# EAGLE board CFT-PB2-smd-revD (EAGLE 5.11), part 1 of 2
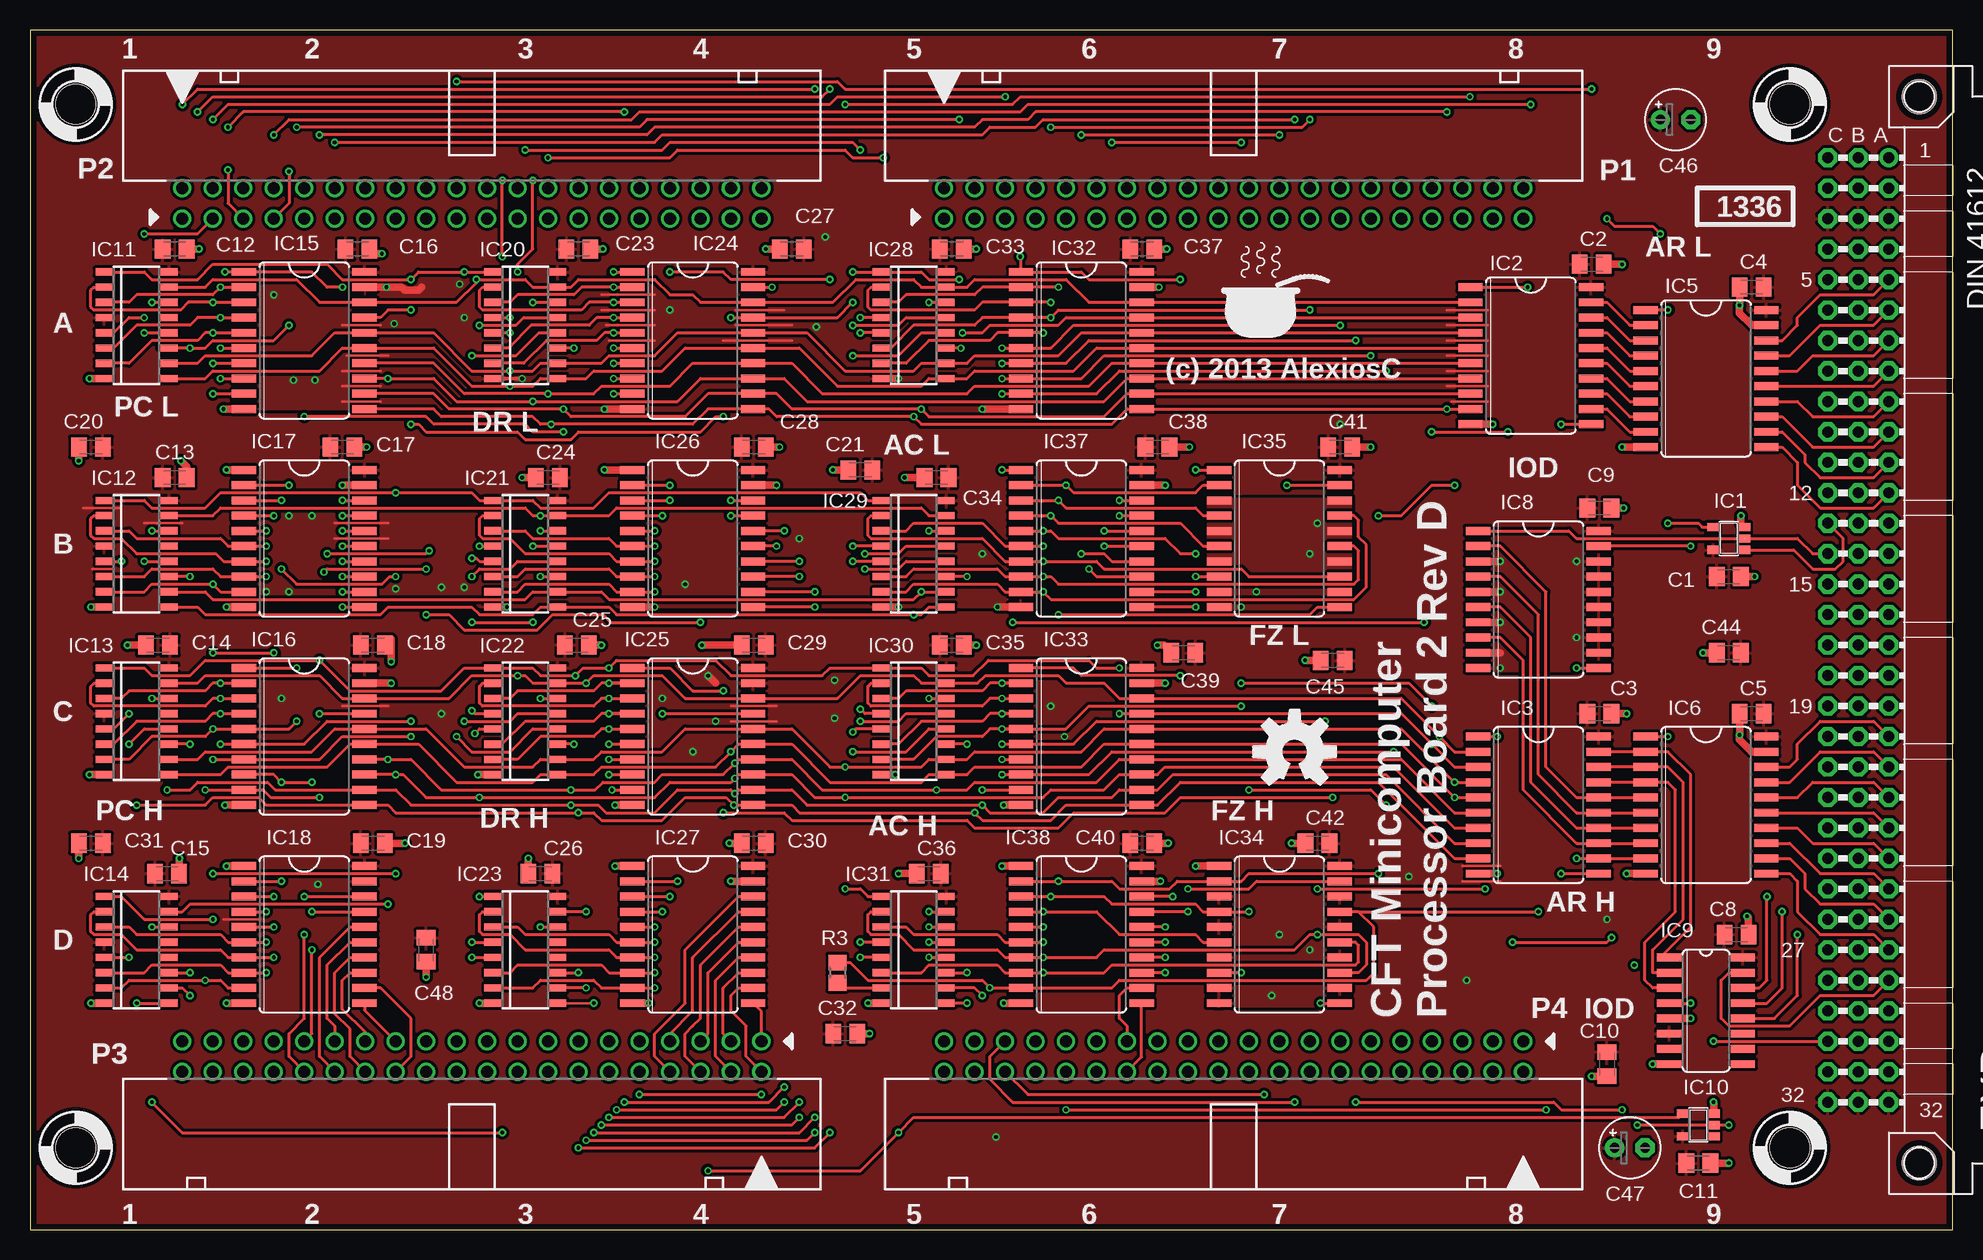
[diagram p6: board, top side]
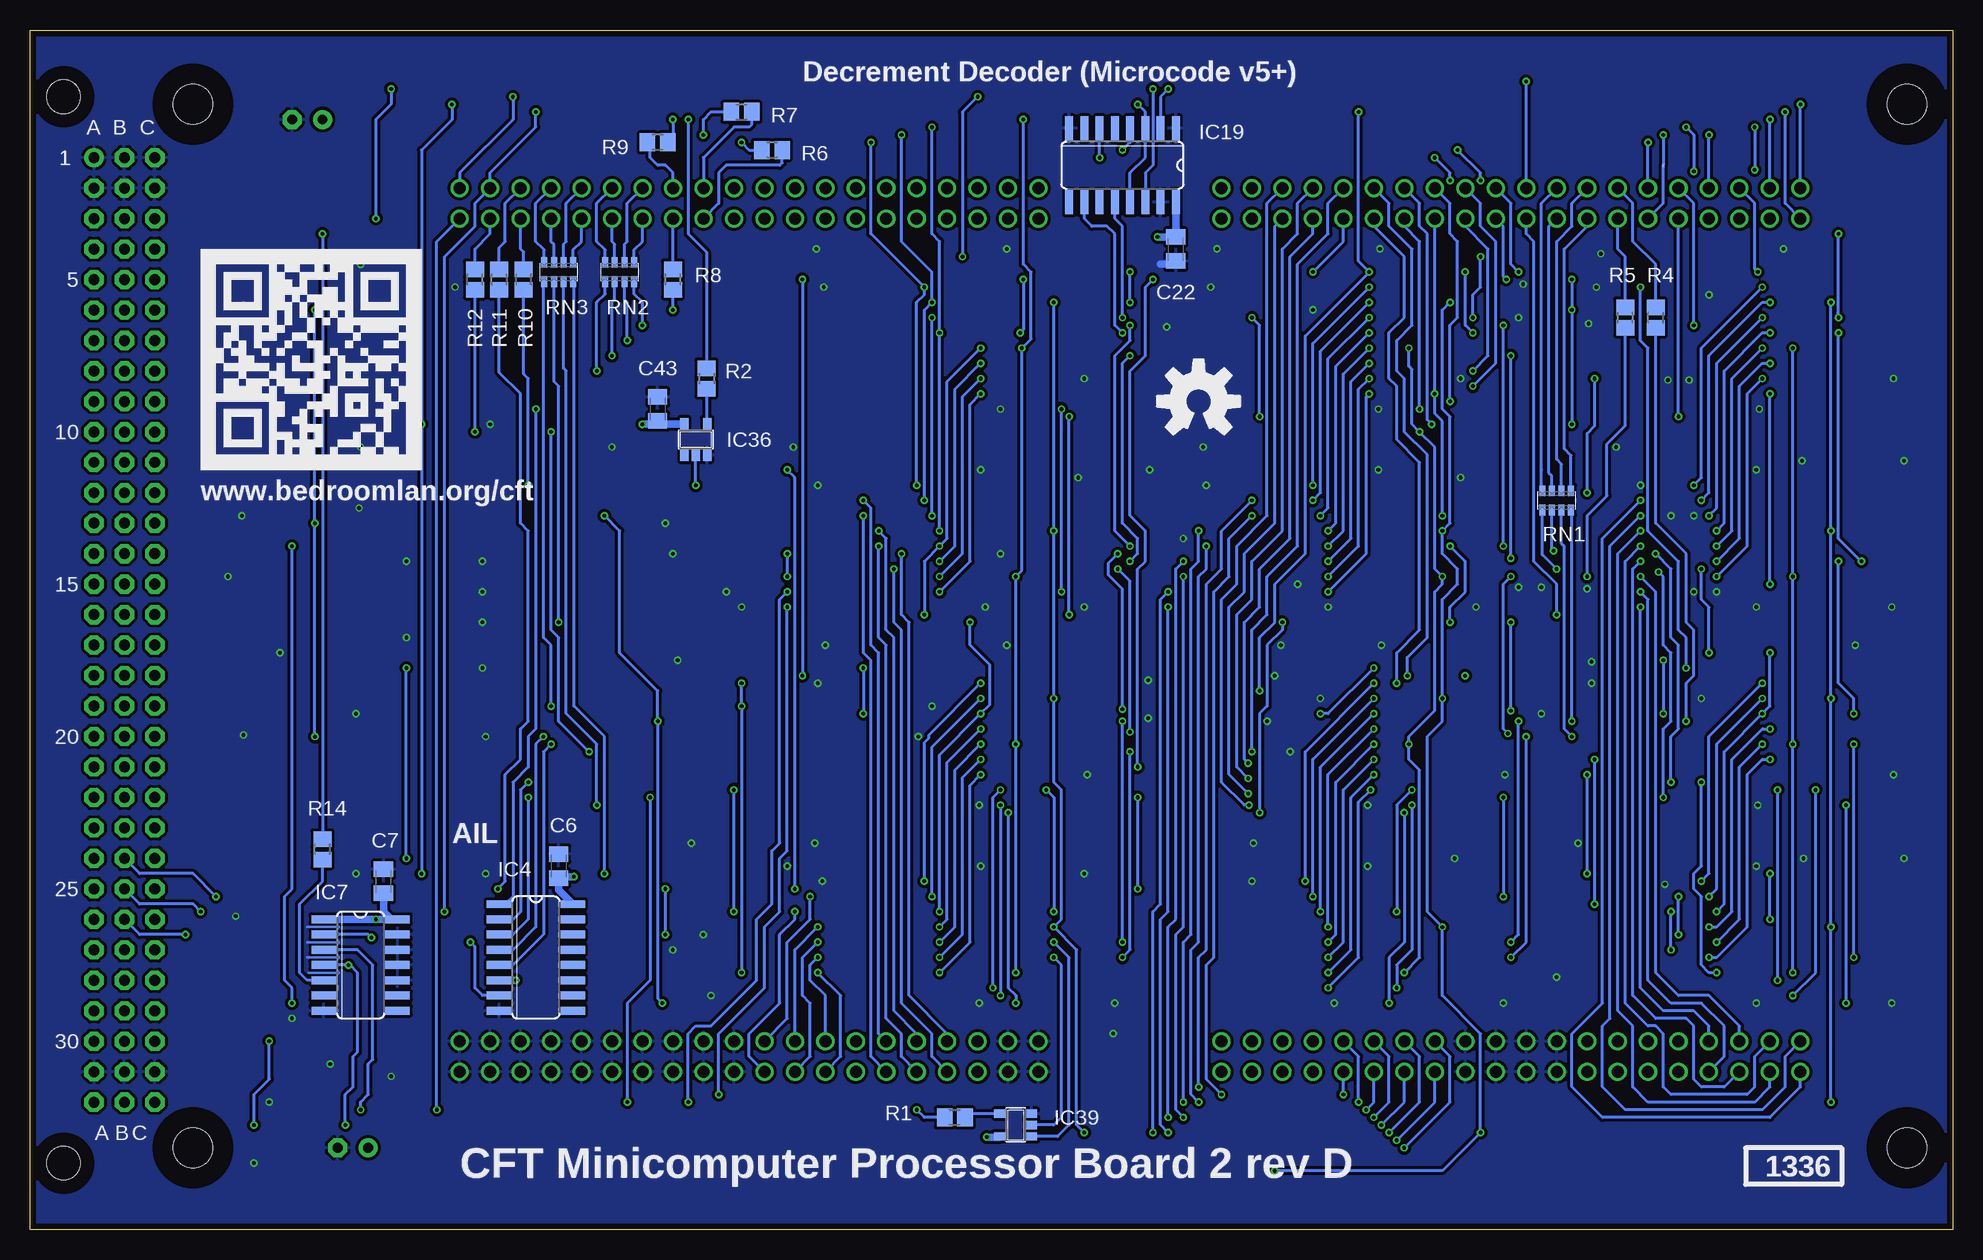
[diagram p7: board, bottom side, seen from below]

Size 160.27 x 100.03 mm. Coordinates in mm from the lower left corner, seen from the top.
Copper layers (1*16): Top 0.035mm / dielectric 1.5mm / Bottom 0.035mm
Design rules "smart-prototyping *": minimum track width 7mil, minimum drill 12mil, track to track 7mil, track to pad 7mil, pad to pad 7mil, via to via 7mil, smd to smd 0mil, copper to edge 20mil, drill to drill 10mil, minimum pad ring 10mil, minimum via ring 6mil, stop-mask expansion 2mil, vias tented up to drill 25mil, thermal gap 10mil
Net classes: 0 default: width 0.254 mm, clearance 0.152 mm; 1 low power: width 0.305 mm, clearance 0.152 mm; 2 LED power: width 0.406 mm, clearance 0.254 mm

## Footprints (pad centres in the part's own frame; a part is rotated, then mirrored left to right if it is on the bottom)
C0805K = smd 1.3 x 1.6: 1 -1,0; 2 1,0
E2,5-5 = drill 0.813 pad 1.6 round: + -1.27,0 | drill 0.813 pad 1.6 octagon: - 1.27,0
VG96K = drill 0.914 pad 1.6 round: A1 154.94,39.37 | drill 0.914 pad 1.6 octagon: A2 154.94,36.83; A3 154.94,34.29; A4 154.94,31.75; A5 154.94,29.21; A6 154.94,26.67; A7 154.94,24.13; A8 154.94,21.59; A9 154.94,19.05; A10 154.94,16.51; A11 154.94,13.97; A12 154.94,11.43; A13 154.94,8.89; A14 154.94,6.35; A15 154.94,3.81; A16 154.94,1.27; A17 154.94,-1.27; A18 154.94,-3.81; A19 154.94,-6.35; A20 154.94,-8.89; A21 154.94,-11.43; A22 154.94,-13.97; A23 154.94,-16.51; A24 154.94,-19.05; A25 154.94,-21.59; A26 154.94,-24.13; A27 154.94,-26.67; A28 154.94,-29.21; A29 154.94,-31.75; A30 154.94,-34.29; A31 154.94,-36.83; A32 154.94,-39.37; B1 152.4,39.37; B2 152.4,36.83; B3 152.4,34.29; B4 152.4,31.75; B5 152.4,29.21; B6 152.4,26.67; B7 152.4,24.13; B8 152.4,21.59; B9 152.4,19.05; B10 152.4,16.51; B11 152.4,13.97; B12 152.4,11.43; B13 152.4,8.89; B14 152.4,6.35; B15 152.4,3.81; B16 152.4,1.27; B17 152.4,-1.27; B18 152.4,-3.81; B19 152.4,-6.35; B20 152.4,-8.89; B21 152.4,-11.43; B22 152.4,-13.97; B23 152.4,-16.51; B24 152.4,-19.05; B25 152.4,-21.59; B26 152.4,-24.13; B27 152.4,-26.67; B28 152.4,-29.21; B29 152.4,-31.75; B30 152.4,-34.29; B31 152.4,-36.83; B32 152.4,-39.37; C1 149.86,39.37; C2 149.86,36.83; C3 149.86,34.29; C4 149.86,31.75; C5 149.86,29.21; C6 149.86,26.67; C7 149.86,24.13; C8 149.86,21.59; C9 149.86,19.05; C10 149.86,16.51; C11 149.86,13.97; C12 149.86,11.43; C13 149.86,8.89; C14 149.86,6.35; C15 149.86,3.81; C16 149.86,1.27; C17 149.86,-1.27; C18 149.86,-3.81; C19 149.86,-6.35; C20 149.86,-8.89; C21 149.86,-11.43; C22 149.86,-13.97; C23 149.86,-16.51; C24 149.86,-19.05; C25 149.86,-21.59; C26 149.86,-24.13; C27 149.86,-26.67; C28 149.86,-29.21; C29 149.86,-31.75; C30 149.86,-34.29; C31 149.86,-36.83; C32 149.86,-39.37 | hole 2.794: 157.48,44.45; 157.48,-44.45
SOT23-5 = smd 0.69 x 0.99: 1 -0.95,-1.29; 2 0,-1.29; 3 0.95,-1.29; 4 0.95,1.3; 5 -0.95,1.3
SO20W = smd 0.66 x 2.032: 1 -5.715,-5.029; 2 -4.445,-5.029; 3 -3.175,-5.029; 4 -1.905,-5.029; 5 -0.635,-5.029; 6 0.635,-5.029; 7 1.905,-5.029; 8 3.175,-5.029; 9 4.445,-5.029; 10 5.715,-5.029; 11 5.715,5.029; 12 4.445,5.029; 13 3.175,5.029; 14 1.905,5.029; 15 0.635,5.029; 16 -0.635,5.029; 17 -1.905,5.029; 18 -3.175,5.029; 19 -4.445,5.029; 20 -5.715,5.029
SO16 = smd 0.66 x 2.032: 1 -4.445,-3.073; 2 -3.175,-3.073; 3 -1.905,-3.073; 4 -0.635,-3.073; 5 0.635,-3.073; 6 1.905,-3.073; 7 3.175,-3.073; 8 4.445,-3.073; 9 4.445,3.073; 10 3.175,3.073; 11 1.905,3.073; 12 0.635,3.073; 13 -0.635,3.073; 14 -1.905,3.073; 15 -3.175,3.073; 16 -4.445,3.073
SO14 = smd 0.66 x 2.032: 1 -3.81,-3.073; 2 -2.54,-3.073; 3 -1.27,-3.073; 4 0,-3.073; 5 1.27,-3.073; 6 2.54,-3.073; 7 3.81,-3.073; 8 3.81,3.073; 9 2.54,3.073; 10 1.27,3.073; 11 0,3.073; 12 -1.27,3.073; 13 -2.54,3.073; 14 -3.81,3.073
SO16D = smd 0.6 x 1.4: 1 -4.445,-2.715; 2 -3.175,-2.715; 3 -1.905,-2.715; 4 -0.635,-2.715; 5 0.635,-2.715; 6 1.905,-2.715; 7 3.175,-2.715; 8 4.445,-2.715; 9 4.445,2.715; 10 3.175,2.715; 11 1.905,2.715; 12 0.635,2.715; 13 -0.635,2.715; 14 -1.905,2.715; 15 -3.175,2.715; 16 -4.445,2.715
PAK100/2500-5-40 = drill 1 pad 1.422 round: 1 -24.13,-1.27; 2 -24.13,1.27; 3 -21.59,-1.27; 4 -21.59,1.27; 5 -19.05,-1.27; 6 -19.05,1.27; 7 -16.51,-1.27; 8 -16.51,1.27; 9 -13.97,-1.27; 10 -13.97,1.27; 11 -11.43,-1.27; 12 -11.43,1.27; 13 -8.89,-1.27; 14 -8.89,1.27; 15 -6.35,-1.27; 16 -6.35,1.27; 17 -3.81,-1.27; 18 -3.81,1.27; 19 -1.27,-1.27; 20 -1.27,1.27; 21 1.27,-1.27; 22 1.27,1.27; 23 3.81,-1.27; 24 3.81,1.27; 25 6.35,-1.27; 26 6.35,1.27; 27 8.89,-1.27; 28 8.89,1.27; 29 11.43,-1.27; 30 11.43,1.27; 31 13.97,-1.27; 32 13.97,1.27; 33 16.51,-1.27; 34 16.51,1.27; 35 19.05,-1.27; 36 19.05,1.27; 37 21.59,-1.27; 38 21.59,1.27; 39 24.13,-1.27; 40 24.13,1.27
R0805 = smd 1.3 x 1.5: 1 -0.85,0; 2 0.85,0
CTS742C083 = smd 0.5 x 0.9: 1 -1.2,-0.8; 2 -0.4,-0.8; 3 0.4,-0.8; 4 1.2,-0.8; 5 1.2,0.8; 6 0.4,0.8; 7 -0.4,0.8; 8 -1.2,0.8
STANDOFF_28_60 = hole 3.302: 0,0
SIGNAL-RENAME = smd 0.305 x 0.152: P$1 0,0; P$2 0,0

## Placement (x,y rotation side)
$4_37_$  SIGNATURESILK  [SIGNATURE]  99.69,74.14 0 top
$4_39_$  OSHW-LOGOL  [OSHW-LOGO-L]  105.41,39.85 0 top
$4_39_$1  OSHW-LOGOL  [OSHW-LOGO-L]  62.87,69.06 0 bottom
$4_40_$  QRCODE-CFT  [CFT-QRCODE]  146.05,63.35 0 bottom
C1  0.1uF  [C0805K]  141.6,54.46 180 top
C2  0.1uF  [C0805K]  130.18,80.49 180 top
C3  0.1uF  [C0805K]  130.81,43.03 180 top
C4  0.1uF  [C0805K]  143.51,78.59 0 top
C5  0.1uF  [C0805K]  143.51,43.03 0 top
C6  0.1uF  [C0805K]  116.2,30.33 270 bottom
C7  0.1uF  [C0805K]  130.81,29.06 270 bottom
C8  0.1uF  [C0805K]  142.24,24.61 180 top
C9  0.1uF  [C0805K]  130.81,60.17 180 top
C10  1uF  [C0805K]  131.44,13.82 90 top
C11  0.1uF  [C0805K]  139.06,5.56 180 top
C12  0.1uF  [C0805K]  12.06,81.76 180 top
C13  0.1uF  [C0805K]  12.06,62.71 180 top
C14  0.1uF  [C0805K]  10.67,48.74 0 top
C15  0.1uF  [C0805K]  11.43,29.69 180 top
C16  0.1uF  [C0805K]  27.3,81.76 180 top
C17  0.1uF  [C0805K]  26.04,65.25 180 top
C18  0.1uF  [C0805K]  28.57,48.74 180 top
C19  0.1uF  [C0805K]  28.57,32.23 0 top
C20  1uF  [C0805K]  5.08,65.25 0 top
C21  1uF  [C0805K]  69.22,63.35 0 top
C22  0.1uF  [C0805K]  64.77,81.76 90 bottom
C23  0.1uF  [C0805K]  45.72,81.76 180 top
C24  0.1uF  [C0805K]  43.18,62.71 0 top
C25  0.1uF  [C0805K]  45.59,48.74 180 top
C26  0.1uF  [C0805K]  42.55,29.69 0 top
C27  0.1uF  [C0805K]  63.5,81.76 0 top
C28  0.1uF  [C0805K]  60.33,65.25 180 top
C29  0.1uF  [C0805K]  60.33,48.74 0 top
C30  0.1uF  [C0805K]  60.33,32.23 180 top
C31  1uF  [C0805K]  5.08,32.23 0 top
C32  1uF  [C0805K]  67.94,16.36 180 top
C33  0.1uF  [C0805K]  76.83,81.76 180 top
C34  0.1uF  [C0805K]  75.56,62.71 0 top
C35  0.1uF  [C0805K]  76.83,48.74 180 top
C36  0.1uF  [C0805K]  74.93,29.69 0 top
C37  0.1uF  [C0805K]  92.71,81.76 180 top
C38  0.1uF  [C0805K]  93.98,65.25 180 top
C39  0.1uF  [C0805K]  96.14,48.11 0 top
C40  0.1uF  [C0805K]  92.71,32.23 180 top
C41  0.1uF  [C0805K]  109.22,65.25 180 top
C42  0.1uF  [C0805K]  107.31,32.23 0 top
C43  0.1uF  [C0805K]  107.95,68.43 90 bottom
C44  1uF  [C0805K]  141.6,48.11 0 top
C45  1uF  [C0805K]  108.58,47.47 0 top
C46  47uF  [E2,5-5]  137.16,92.56 0 top
C47  47uF  [E2,5-5]  133.35,6.83 0 top
C48  1uF  [C0805K]  33.02,23.34 90 top
EXP  [VG96K]  0,50.01 0 top
IC1  74AHC1G08DBV  [SOT23-5]  141.6,57.63 90 top
IC2  74HC574D  [SO20W]  125.09,72.87 270 top
IC3  74HC574D  [SO20W]  125.73,35.41 270 top
IC4  74HC138D  [SO16]  118.11,22.71 270 bottom
IC5  74HC541DW  [SO20W]  139.7,70.97 270 top
IC6  74HC541DW  [SO20W]  139.7,35.41 270 top
IC7  74HC74D  [SO14]  132.72,22.07 270 bottom
IC8  74HC688DW  [SO20W]  125.73,52.55 270 top
IC9  74HC138D  [SO16]  139.7,18.26 270 top
IC10  74AHC1G04DBV  [SOT23-5]  139.06,8.74 90 top
IC11  74HC193D  [SO16D]  8.89,75.41 270 top
IC12  74HC193D  [SO16D]  8.89,56.36 270 top
IC13  74HC193D  [SO16D]  8.89,42.39 270 top
IC14  74HC193D  [SO16D]  8.89,23.34 270 top
IC15  74HC541DW  [SO20W]  22.86,74.14 270 top
IC16  74HC541DW  [SO20W]  22.86,41.12 270 top
IC17  74HC541DW  [SO20W]  22.86,57.63 270 top
IC18  74HC541DW  [SO20W]  22.86,24.61 270 top
IC19  74HC139D  [SO16]  69.22,88.75 180 bottom
IC20  74HC193D  [SO16D]  41.27,75.41 270 top
IC21  74HC193D  [SO16D]  41.27,56.36 270 top
IC22  74HC193D  [SO16D]  41.27,42.39 270 top
IC23  74HC193D  [SO16D]  41.27,23.34 270 top
IC24  74HC541DW  [SO20W]  55.24,74.14 270 top
IC25  74HC541DW  [SO20W]  55.24,41.12 270 top
IC26  74HC541DW  [SO20W]  55.24,57.63 270 top
IC27  74HC541DW  [SO20W]  55.24,24.61 270 top
IC28  74HC193D  [SO16D]  73.66,75.41 270 top
IC29  74HC193D  [SO16D]  73.66,56.36 270 top
IC30  74HC193D  [SO16D]  73.66,42.39 270 top
IC31  74HC193D  [SO16D]  73.66,23.34 270 top
IC32  74HC541DW  [SO20W]  87.63,74.14 270 top
IC33  74HC541DW  [SO20W]  87.63,41.12 270 top
IC34  74HC688DW  [SO20W]  104.14,24.61 270 top
IC35  74HC688DW  [SO20W]  104.14,57.63 270 top
IC36  74AHC1G04DBV  [SOT23-5]  104.78,65.89 0 bottom
IC37  74HC541DW  [SO20W]  87.63,57.63 270 top
IC38  74HC541DW  [SO20W]  87.63,24.61 270 top
IC39  74AHC1G08DBV  [SOT23-5]  78.11,8.74 90 bottom
P1  2540-5  [PAK100/2500-5-40]  100.33,85.57 0 top
P2  2540-5  [PAK100/2500-5-40]  36.83,85.57 0 top
P3  2540-5  [PAK100/2500-5-40]  36.83,14.45 180 top
P4  2540-5  [PAK100/2500-5-40]  100.33,14.45 180 top
R1  30R  [R0805]  83.19,9.37 0 bottom
R2  30R  [R0805]  103.89,70.97 270 bottom
R3  30R  [R0805]  67.31,21.44 270 top
R4  30R  [R0805]  24.77,76.05 90 bottom
R5  30R  [R0805]  27.3,76.05 90 bottom
R6  30R  [R0805]  98.42,90.02 0 bottom
R7  30R  [R0805]  100.97,93.19 0 bottom
R8  30R  [R0805]  106.68,79.22 90 bottom
R9  30R  [R0805]  107.95,90.65 180 bottom
R10  30R  [R0805]  119.13,79.22 90 bottom
R11  30R  [R0805]  121.16,79.22 90 bottom
R12  30R  [R0805]  123.19,79.22 90 bottom
R14  30R  [R0805]  135.89,31.72 90 bottom
RN1  30R  [CTS742C083]  33.02,60.81 180 bottom
RN2  30R  [CTS742C083]  111.12,79.86 180 bottom
RN3  30R  [CTS742C083]  116.2,79.86 180 bottom
U1  HOLE  [STANDOFF_28_60]  3.81,93.83 0 top
U2  HOLE  [STANDOFF_28_60]  3.81,6.83 0 top
U3  HOLE  [STANDOFF_28_60]  146.69,6.83 0 top
U4  HOLE  [STANDOFF_28_60]  146.69,93.83 0 top
X1  SIGNAL-RENAME  [SIGNAL-RENAME]  24.13,88.75 270 bottom

## Tracks (layer width: path | path; a pad name or v marks a point on that pad's centre or on a via)
!ABEN  (via drill 0.3)
  Top 0.254: v136.53,76.68 IC5.1 | IC6.1 v136.53,41.12 | IC1.4 139.38,58.58 139.06,58.9 v136.53,58.9
  Bottom 0.254: v136.53,41.12 v136.53,58.9 v136.53,76.68
!ACB1  (via drill 0.3)
  Top 0.254: IC29.4 v68.58,57 | v68.58,75.41 72.39,75.41 73.03,76.05 IC28.13
  Bottom 0.254: v68.58,57 69.85,58.27 69.85,72.87 68.58,74.14 v68.58,75.41
!ACB2  (via drill 0.3)
  Top 0.254: IC30.4 69.6,43.03 v69.22,43.41 | v69.6,56.36 72.39,56.36 73.03,57 IC29.13
  Bottom 0.254: v69.6,56.36 70.36,55.6 70.36,54.58 69.22,53.44 v69.22,43.41
!ACB3  (via drill 0.3)
  Top 0.254: IC31.4 v69.22,23.98 | v69.22,42.39 72.39,42.39 73.03,43.03 IC30.13
  Bottom 0.254: v69.22,23.98 v69.22,42.39
!ACC1  (via drill 0.3)
  Top 0.254: v68.58,72.87 72.39,72.87 74.3,74.78 IC28.12 | IC29.5 v68.58,55.73
  Bottom 0.254: v68.58,72.87 69.22,72.24 69.22,58.9 67.94,57.63 67.94,56.36 v68.58,55.73
!ACC2  (via drill 0.3)
  Top 0.254: IC30.5 68.83,41.76 v68.58,41.5 | v69.6,55.09 72.39,55.09 73.03,55.73 IC29.12
  Bottom 0.254: v68.58,41.5 68.58,54.08 v69.6,55.09
!ACC3  (via drill 0.3)
  Top 0.254: IC31.5 v69.22,22.71 | v68.58,39.85 73.03,39.85 74.93,41.76 IC30.12
  Bottom 0.254: v69.22,22.71 68.58,23.34 v68.58,39.85
!ACCPL  (via drill 0.3)
  Top 0.254: v86.36,10.01 v126.36,10.01
  Bottom 0.254: v126.36,10.01 126.36,82.4 P1.39 | R1.1 85.72,9.37 v86.36,10.01
!ACDOWN  (via drill 0.3)
  Top 0.254: IC28.4 v69.22,76.05
  Bottom 0.254: v69.22,76.05 69.22,83.67 69.85,84.3 IC19.12
!ACUP  (via drill 0.3)
  Top 0.254: IC28.5 v69.22,74.78
  Bottom 0.254: v69.22,74.78 69.85,75.41 69.85,83.03 70.48,83.67 71.75,83.67 72.39,84.3 IC19.10
!AINDEX  (via drill 0.3)
  Top 0.254: v35.56,95.73 67.31,95.73 67.94,95.1 v130.18,95.1 | v135.89,83.03 135.25,83.67 132.08,83.67 v131.44,84.3
  Bottom 0.254: P2.20 v35.56,95.73 | v135.89,83.03 R14.2 | v130.18,95.1 130.18,93.83 131.44,92.56 v131.44,84.3
!DEC  (via drill 0.3)
  Top 0.254: v67.94,93.83 81.92,93.83 82.55,94.46 v120.02,94.46
  Bottom 0.254: IC19.13 68.58,88.11 67.31,89.38 IC19.3 67.31,93.19 v67.94,93.83 | v120.02,94.46 120.02,92.56 124.46,88.11 P1.40
!DECCPL  (via drill 0.3)
  Top 0.254: v74.93,23.98 IC31.13
  Bottom 0.254: v74.93,23.98 73.66,22.71 73.66,8.74 74.61,7.79 IC39.1
!DRB1  (via drill 0.3)
  Top 0.254: IC20.13 41.15,76.05 40.51,75.41 v37.47,75.41 | v37.47,57 IC21.4
  Bottom 0.254: v37.47,57 v37.47,75.41
!DRB2  (via drill 0.3)
  Top 0.254: v41.91,57 IC21.13 | v36.83,50.65 v41.91,50.65 | v36.83,43.28 37.08,43.03 IC22.4
  Bottom 0.254: v41.91,50.65 41.91,51.92 40.64,53.19 40.64,55.73 v41.91,57 | v36.83,43.28 v36.83,50.65
!DRB3  (via drill 0.3)
  Top 0.254: v36.83,23.98 IC23.4 | v36.2,42.39 40.01,42.39 40.64,43.03 IC22.13
  Bottom 0.254: v36.83,23.98 36.2,24.61 v36.2,42.39
!DRC1  (via drill 0.3)
  Top 0.254: IC20.12 42.42,74.78 40.51,72.87 v36.83,72.87 | v36.83,55.98 37.21,55.98 37.47,55.73 IC21.5
  Bottom 0.254: v36.83,55.98 v36.83,72.87
!DRC2  (via drill 0.3)
  Top 0.254: IC21.12 40.64,55.73 40.01,55.09 37.47,55.09 v36.83,54.46 | v37.08,41.38 37.47,41.76 IC22.5
  Bottom 0.254: v37.08,41.38 37.47,41.76 37.47,53.82 v36.83,54.46
!DRC3  (via drill 0.3)
  Top 0.254: v36.83,22.71 IC23.5 | v35.56,41.12 36.83,39.85 40.01,39.85 41.91,41.76 IC22.12
  Bottom 0.254: v36.83,22.71 35.56,23.98 v35.56,41.12
!DRDOWN  (via drill 0.3)
  Top 0.254: v39.37,81.13 v39.37,87.48 | IC20.4 v40.01,76.05 | v41.27,90.02 52.7,90.02 53.34,90.65 68.58,90.65 v69.22,90.02
  Bottom 0.254: v69.22,90.02 68.58,90.65 IC19.4 | v39.37,87.48 39.37,88.11 v41.27,90.02 | v39.37,81.13 39.37,78.59 40.01,77.95 v40.01,76.05
!DRUP  (via drill 0.3)
  Top 0.254: IC20.5 v40.01,74.78 | v41.91,87.48 41.91,81.76 40.64,80.49 v40.64,79.86 | v43.18,89.38 53.34,89.38 53.98,90.02 67.94,90.02 68.58,89.38 v71.12,89.38
  Bottom 0.254: v71.12,89.38 IC19.6 | v40.01,74.78 40.64,75.41 v40.64,79.86 | v41.91,87.48 41.91,88.11 v43.18,89.38
!FZERO  (via drill 0.3)
  Top 0.254: v104.78,62.08 IC35.19
  Bottom 0.254: v104.78,62.08 IC36.2
!INCCPL  (via drill 0.3)
  Top 0.254: v74.93,22.71 IC31.12
  Bottom 0.254: v74.93,22.71 74.3,22.07 74.3,9.37 74.93,8.74 IC39.2
!INCPC  (via drill 0.3)
  Top 0.254: v9.53,83.03 13.97,83.03 P2.3 | v9.53,76.05 8.26,76.05 6.99,74.78 IC11.5
  Bottom 0.254: v9.53,76.05 v9.53,83.03
!IO
  Top 0.254: IC8.1 128.27,58.27 128.91,57.63 IC1.2 147.32,57.63 148.59,56.36 EXP.C14
!IODEV1XX  (via drill 0.3)
  Top 0.254: IC9.14 144.15,20.17 144.78,20.8 v144.78,27.79
  Bottom 0.254: v144.78,27.79 146.69,29.69 151.13,29.69 EXP.B24
!IODEV2XX  (via drill 0.3)
  Top 0.254: v146.05,26.52 146.05,20.17 144.78,18.9 IC9.13
  Bottom 0.254: EXP.B25 151.13,27.15 146.69,27.15 v146.05,26.52
!IODEV3XX  (via drill 0.3)
  Top 0.254: IC9.12 145.41,17.63 147.32,19.53 v147.32,24.61
  Bottom 0.254: v147.32,24.61 151.13,24.61 EXP.B26
!IS_AUTOINDEX  (via drill 0.3)
  Top 0.254: v123.57,23.98 131.44,23.98 v131.83,24.36
  Bottom 0.254: IC4.7 122.56,19.53 123.19,20.17 123.19,23.6 v123.57,23.98 | v131.83,24.36 132.08,24.61 IC7.2
!MEM
  Top 0.254: EXP.C13 151.13,57.63 151.13,55.73 150.5,55.09 148.59,55.09 147,56.68 IC1.1
!RAC  (via drill 0.3)
  Top 0.254: v95.89,79.22 88.27,79.22 87.63,79.86 IC32.1 82.55,79.91 v82.55,81.13 | v95.89,46.2 87.63,46.2 87,46.84 IC33.1 | v15.24,92.56 16.51,93.83 66.67,93.83 67.31,94.46 v81.28,94.46
  Bottom 0.254: v95.89,79.22 v95.89,46.2 | P2.4 v15.24,92.56 | v81.28,94.46 82.55,93.19 v82.55,81.13
!RDR  (via drill 0.3)
  Top 0.254: v16.51,88.37 16.51,85.57 P2.5 | v48.64,79.86 IC24.1 | v49.53,93.19 17.78,93.19 v16.51,91.92 | IC25.1 53.34,46.84 55.24,44.93 v57.78,44.93
  Bottom 0.254: v57.78,44.93 57.78,49.38 56.52,50.65 56.52,53.82 53.98,56.36 53.98,74.52 v48.64,79.86 49.53,80.75 v49.53,93.19 | v16.51,91.92 v16.51,88.37
!RESET  (via drill 0.3)
  Top 0.254: v141.6,8.74 IC10.2 v133.99,8.74 | v140.34,15.72 EXP.C30
  Bottom 0.254: v133.99,8.74 133.99,11.28 133.35,11.91 133.35,14.45 132.97,14.83 132.97,21.44 133.6,22.07 v133.73,22.07 IC7.4 | v141.6,8.74 141.6,11.28 140.34,12.55 v140.34,15.72
!RPC  (via drill 0.3)
  Top 0.254: v16.26,79.86 IC15.1 23.5,79.86 24.77,78.59 v26.04,78.59 | IC16.1 v22.23,46.84
  Bottom 0.254: v16.26,79.86 16.51,80.11 16.51,85.57 P2.6 | v22.23,46.84 22.23,49.38 22.86,50.01 22.86,55.73 25.4,58.27 25.4,73.51 26.04,74.14 v26.04,78.59
!STPAC  (via drill 0.3)
  Top 0.254: v66.67,95.1 66.04,94.46 15.24,94.46 v13.97,93.19
  Bottom 0.254: IC19.14 67.31,88.11 66.67,88.75 v66.67,95.1 | v13.97,93.19 13.97,85.57 P2.1
!STPDR  (via drill 0.3)
  Top 0.254: v12.7,93.83 13.97,95.1 v65.41,95.1
  Bottom 0.254: v65.41,95.1 66.04,94.46 IC19.2 | P2.2 v12.7,93.83
!SYSDEV
  Top 0.254: IC9.15 141.6,21.44 140.97,20.8 140.97,17.63 141.6,16.99 146.69,16.99 149.22,19.53 153.67,19.53 EXP.A28
!WAC  (via drill 0.3)
  Top 0.254: IC31.11 v78.11,21.44 | v78.11,40.49 IC30.11 | v78.11,54.46 IC29.11 | v77.6,73.51 IC28.11 | v21.59,88.24 21.59,85.57 P2.7 | v22.23,91.92 50.8,91.92 51.44,92.56 v77.47,92.56
  Bottom 0.254: v78.11,21.44 v78.11,40.49 v78.11,54.46 77.6,54.97 v77.6,73.51 76.83,74.27 76.83,79.86 77.47,80.49 v77.47,92.56 | v21.59,88.24 21.59,91.29 v22.23,91.92
!WAR  (via drill 0.3)
  Top 0.254: v127.64,67.16 IC2.11 | v127.64,29.69 IC3.11 | v125.09,93.83 83.19,93.83 82.55,93.19 50.8,93.19 50.16,92.56 21.59,92.56 v20.32,91.29
  Bottom 0.254: v127.64,29.69 v127.64,67.16 127.64,90.02 125.09,92.56 v125.09,93.83 | P2.8 v20.32,91.29
!WDR  (via drill 0.3)
  Top 0.254: IC23.11 v45.72,21.44 | v45.34,40.49 IC22.11 | v42.55,54.46 IC21.11 | v45.34,73.51 IC20.11 | v22.86,67.79 33.02,67.79 33.66,67.16 41.27,67.16 41.91,66.52 v44.45,66.52
  Bottom 0.254: v45.72,21.44 44.45,22.71 44.45,38.33 45.34,39.22 v45.34,40.49 45.34,41.12 43.18,43.28 43.18,53.19 42.55,53.82 v42.55,54.46 43.18,55.09 43.18,65.25 v44.45,66.52 45.09,67.16 45.09,71.73 45.34,71.98 v45.34,73.51 | v22.86,67.79 P2.9
!WIR  (via drill 0.3)
  Top 0.254: v33.02,51.28 34.92,51.28 36.2,50.01 42.29,50.01 43.56,51.28 47.75,51.28 48.39,50.65 v55.88,50.65 | v57.78,34.77 62.87,34.77 63.5,34.14 78.11,34.14 78.74,33.5 85.72,33.5 87,34.77 94.61,34.77 95.89,36.04 v108.58,36.04 | v110.49,10.64 127,10.64 127.64,10.01 v132.72,10.01
  Bottom 0.254: v33.02,51.28 33.02,53.82 34.92,55.73 34.92,82.4 35.56,83.03 P2.19 | v55.88,50.65 55.88,50.01 57.15,48.74 57.15,43.66 57.78,43.03 v57.78,34.77 | v108.58,36.04 108.58,20.8 110.49,18.9 v110.49,10.64 | v132.72,10.01 132.72,10.64 132.08,11.28 132.08,13.82 131.7,14.2 131.7,22.07 132.97,23.34 IC7.3
!WPC  (via drill 0.3)
  Top 0.254: v21.59,75.41 20.32,74.14 15.24,74.14 14.61,73.51 v13.34,73.51 IC11.11 10.79,73.51 | v13.34,54.46 IC12.11 | v13.34,40.49 IC13.11 | IC14.11 v13.34,21.44
  Bottom 0.254: v21.59,75.41 21.59,85.57 P2.10 | v13.34,73.51 v13.34,54.46 v13.34,40.49 v13.34,21.44
+3.3V
  Top 0.254: EXP.C4 EXP.B4 EXP.A4
AB0
  Top 0.254: IC5.18 146.05,74.14 147.32,75.41 147.32,76.05 149.22,77.95 153.67,77.95 EXP.A5
AB1
  Top 0.254: IC5.17 146.69,72.87 149.22,75.41 153.67,75.41 EXP.A6
AB2
  Top 0.254: IC5.16 147.32,71.6 148.59,72.87 153.67,72.87 EXP.A7
AB3
  Top 0.254: IC5.15 153.67,70.33 EXP.A8
AB4
  Top 0.254: IC5.14 147.32,69.06 148.59,67.79 153.67,67.79 EXP.A9
AB5
  Top 0.254: IC5.13 146.05,67.79 148.59,65.25 153.67,65.25 EXP.A10
AB6
  Top 0.254: IC5.12 146.05,66.52 147.96,64.62 147.96,63.98 149.22,62.71 153.67,62.71 EXP.A11
AB7
  Top 0.254: IC5.11 146.05,65.25 147.32,63.98 147.32,62.08 149.22,60.17 153.67,60.17 EXP.A12
AB8
  Top 0.254: IC6.18 146.69,38.58 147.32,39.22 147.32,40.49 149.22,42.39 153.67,42.39 EXP.A20
AB9
  Top 0.254: IC6.17 146.69,37.31 149.22,39.85 153.67,39.85 EXP.A21
AB10
  Top 0.254: IC6.16 147.32,36.04 148.59,37.31 153.67,37.31 EXP.A22
AB11
  Top 0.254: IC6.15 153.67,34.77 EXP.A23
AB12
  Top 0.254: IC6.14 147.32,33.5 148.59,32.23 153.67,32.23 EXP.A24
AB13
  Top 0.254: IC6.13 146.69,32.23 149.22,29.69 153.67,29.69 EXP.A25
AB14
  Top 0.254: IC6.12 146.69,30.96 147.96,29.69 147.96,28.42 149.22,27.15 153.67,27.15 EXP.A26
AB15
  Top 0.254: IC6.11 146.69,29.69 147.32,29.06 147.32,26.52 149.22,24.61 153.67,24.61 EXP.A27
AC0  (via drill 0.3)
  Top 0.254: IC28.3 72.39,77.32 73.03,77.95 78.74,77.95 79.38,78.59 IC32.2 v85.72,78.59 | IC35.2 97.79,62.08 97.16,61.44 87,61.44 v86.36,62.08 IC37.2 | v90.17,90.65 v100.97,90.65
  Bottom 0.254: v86.36,62.08 86.36,77.32 85.72,77.95 v85.72,78.59 90.17,83.03 v90.17,90.65 | R6.1 100.33,90.02 v100.97,90.65
AC1  (via drill 0.3)
  Top 0.254: IC28.2 70.1,78.59 69.85,78.33 69.85,76.94 70.1,76.68 78.74,76.68 79.38,77.32 IC32.3 v85.09,77.32 | IC35.4 97.79,59.54 97.16,60.17 86.36,60.17 v85.72,60.81 IC37.3 | v87.63,91.29 v104.14,91.29
  Bottom 0.254: v85.72,60.81 85.72,76.68 v85.09,77.32 85.09,79.86 87.63,82.4 v87.63,91.29 | R7.1 103.5,93.19 104.14,92.56 v104.14,91.29
AC2  (via drill 0.3)
  Top 0.254: IC28.6 71.75,73.51 73.66,75.41 78.74,75.41 79.38,76.05 IC32.4 v85.09,76.05 85.72,76.68 v106.68,76.68 | IC35.6 97.79,57 95.89,58.9 85.72,58.9 v85.09,59.54 IC37.4
  Bottom 0.254: v85.09,59.54 v85.09,76.05 | v106.68,76.68 R8.1
AC3  (via drill 0.3)
  Top 0.254: IC28.7 73.03,72.24 74.93,74.14 80.01,74.14 80.64,74.78 IC32.5 v84.45,74.78 | IC37.5 v84.45,58.27 85.09,58.27 85.72,57.63 94.61,57.63 95.89,56.36 v97.16,56.36 | v97.16,54.46 IC35.8 | v85.09,91.92 106.05,91.92 v106.68,92.56
  Bottom 0.254: v97.16,56.36 v97.16,54.46 | v85.09,91.92 85.09,83.03 84.45,82.4 v84.45,74.78 v84.45,58.27 | R9.1 106.68,91.07 v106.68,92.56
AC4  (via drill 0.3)
  Top 0.254: IC29.3 73.03,58.27 73.66,58.9 79.38,58.9 81.28,57 IC37.6 v84.45,57 | v85.72,51.28 106.68,51.28 107.31,51.92 IC35.11 | v81.03,73.51 IC32.6 85.09,73.51 87,75.41 v109.22,75.41
  Bottom 0.254: v85.72,51.28 85.72,55.73 v84.45,57 83.82,57.63 83.82,70.71 v81.03,73.51 | RN2.8 109.92,78.02 109.22,77.32 v109.22,75.41
AC5  (via drill 0.3)
  Top 0.254: IC29.2 70.1,59.54 69.85,59.28 69.85,57.89 70.1,57.63 79.38,57.63 81.28,55.73 IC37.7 v84.45,55.73 88.9,55.73 89.53,55.09 100.97,55.09 101.6,54.46 IC35.13 | v110.49,74.14 88.27,74.14 86.36,72.24 IC32.7 v81.03,72.24
  Bottom 0.254: v84.45,55.73 83.19,57 83.19,70.08 v81.03,72.24 | RN2.7 110.72,77.55 110.49,77.32 v110.49,74.14
AC6  (via drill 0.3)
  Top 0.254: IC29.6 73.03,54.46 73.66,55.09 80.64,55.09 81.28,54.46 IC37.8 v84.45,54.46 85.09,54.46 85.72,53.82 110.36,53.82 110.74,54.2 110.74,56.62 110.36,57 IC35.15 | v111.76,72.87 89.53,72.87 87.63,70.97 IC32.8 v81.03,70.97
  Bottom 0.254: v84.45,54.46 82.55,56.36 82.55,69.44 v81.03,70.97 | RN2.6 111.53,77.55 111.76,77.32 v111.76,72.87
AC7  (via drill 0.3)
  Top 0.254: IC29.7 73.03,53.19 73.66,53.82 80.64,53.82 81.28,53.19 IC37.9 v84.45,53.19 85.09,52.55 110.36,52.55 111.38,53.57 111.38,57.12 110.74,57.76 110.74,59.16 110.36,59.54 IC35.17 | IC32.9 v81.03,69.7 88.9,69.7 90.81,71.6 v113.03,71.6
  Bottom 0.254: v84.45,53.19 81.92,55.73 81.92,68.81 v81.03,69.7 | RN2.5 112.33,78.02 113.03,77.32 v113.03,71.6
AC8  (via drill 0.3)
  Top 0.254: IC30.3 72.39,44.3 73.03,44.93 79.38,44.93 80.01,45.57 IC33.2 v81.03,45.57 | IC38.2 v85.72,29.06 90.17,29.06 90.81,28.42 95,28.42 95.63,29.06 IC34.2 100.97,29.06 101.6,29.69 v112.39,29.69
  Bottom 0.254: v112.39,29.69 112.39,41.12 114.94,43.66 114.94,78.99 RN3.8 | v85.72,29.06 85.72,40.61 85.34,41 85.34,41.25 v81.03,45.57
AC9  (via drill 0.3)
  Top 0.254: IC30.2 70.1,45.57 69.85,45.31 69.85,43.92 70.1,43.66 79.38,43.66 80.01,44.3 v81.03,44.3 IC33.3 | IC38.3 v85.09,27.79 89.53,27.79 90.17,27.15 97.16,27.15 97.79,26.52 IC34.4 v101.6,26.52 | v101.6,36.68 111.76,36.68 v113.03,35.41
  Bottom 0.254: v113.03,35.41 113.03,40.49 115.57,43.03 115.57,71.6 115.81,71.84 RN3.7 | v101.6,26.52 v101.6,36.68 | v85.09,27.79 85.09,40.23 v81.03,44.3
AC10  (via drill 0.3)
  Top 0.254: IC30.6 72.39,40.49 74.3,42.39 79.38,42.39 80.01,43.03 IC33.4 v81.03,43.03 | IC34.6 97.79,23.98 97.16,24.61 90.81,24.61 88.9,26.52 v84.45,26.52 IC38.4 | v81.92,50.65 v116.2,50.65
  Bottom 0.254: RN3.6 116.61,70.73 116.2,70.33 v116.2,50.65 | v81.92,50.65 81.92,48.74 80.26,47.09 80.26,43.79 v81.03,43.03 84.45,39.6 v84.45,26.52
AC11  (via drill 0.3)
  Top 0.254: IC30.7 73.66,39.22 75.56,41.12 79.38,41.12 80.01,41.76 IC33.5 v81.03,41.76 86.36,41.76 88.27,43.66 v100.97,43.66 | IC38.5 v84.45,25.25 | v100.97,21.44 IC34.8 | v100.97,45.57 114.94,45.57 v116.84,43.66
  Bottom 0.254: v84.45,25.25 83.82,25.88 83.82,38.96 v81.03,41.76 | v100.97,21.44 v100.97,43.66 v100.97,45.57 | v116.84,43.66 116.84,48.74 117.47,49.38 117.47,78.99 RN3.5
AC12  (via drill 0.3)
  Top 0.254: IC31.3 73.03,25.25 73.66,24.61 80.64,24.61 81.28,23.98 IC38.6 v84.45,23.98 | IC33.6 v81.03,40.49 87,40.49 88.9,42.39 v107.95,42.39 | v107.57,18.9 IC34.11 | v112.39,59.54 114.3,59.54 116.84,62.08 v118.75,62.08
  Bottom 0.254: v84.45,23.98 83.19,25.25 83.19,38.33 v81.03,40.49 | v107.57,18.9 107.95,19.28 v107.95,42.39 107.95,44.93 111.12,48.11 111.12,58.27 v112.39,59.54 | R10.1 119.13,71.35 118.75,70.97 v118.75,62.08
AC13  (via drill 0.3)
  Top 0.254: IC31.2 70.1,26.52 69.85,26.26 69.85,24.87 70.1,24.61 72.39,24.61 73.66,23.34 80.64,23.34 81.28,22.71 IC38.7 v84.45,22.71 88.9,22.71 89.53,23.34 105.41,23.34 106.68,24.61 v107.31,24.61 110.74,24.61 111.38,23.98 111.38,22.07 110.74,21.44 IC34.13 | v81.03,39.22 IC33.7 | v107.31,28.42 v121.28,28.42
  Bottom 0.254: v84.45,22.71 82.55,24.61 82.55,37.69 v81.03,39.22 | v121.28,28.42 120.65,29.06 120.65,37.95 119.38,39.22 119.38,41.76 118.75,42.39 118.75,58.27 119.38,58.9 119.38,69.7 121.16,71.48 R11.1 | v107.31,24.61 v107.31,28.42
AC14  (via drill 0.3)
  Top 0.254: IC31.6 74.3,21.44 74.93,22.07 80.64,22.07 81.28,21.44 IC38.8 v84.45,21.44 89.53,21.44 90.17,22.07 110.49,22.07 110.74,22.33 110.74,23.72 110.49,23.98 IC34.15 | v81.03,37.95 IC33.8 88.27,37.95 90.17,39.85 v113.67,39.85 | v116.84,66.52 v123.19,66.52
  Bottom 0.254: v84.45,21.44 81.92,23.98 81.92,37.06 v81.03,37.95 | v116.84,66.52 116.84,50.01 116.2,49.38 116.2,42.39 v113.67,39.85 | v123.19,66.52 R12.1
AC15  (via drill 0.3)
  Top 0.254: v80.01,20.17 90.17,20.17 90.81,20.8 111.38,20.8 112.01,21.44 112.01,25.25 110.74,26.52 | v80.01,20.17 79.38,20.8 69.85,20.8 68.36,22.29 R3.1 | v80.01,20.17 IC38.9 | v79.38,36.68 IC33.9 | 110.74,26.52 v125.73,26.52 | 110.74,26.52 IC34.17 | v118.11,93.19 83.82,93.19 83.19,92.56 79.38,92.56 78.74,91.92 52.07,91.92 51.44,91.29 v24.13,91.29
  Bottom 0.254: v80.01,20.17 80.01,36.04 v79.38,36.68 | v24.13,91.29 X1.P$1 | v125.73,26.52 125.73,81.13 123.19,83.67 123.19,85.57 P1.38 121.92,88.11 118.11,91.92 v118.11,93.19
AR0
  Top 0.254: IC2.19 131.44,77.32 133.35,75.41 IC5.2
AR1
  Top 0.254: IC2.18 131.44,76.05 133.35,74.14 IC5.3
AR2
  Top 0.254: IC2.17 131.44,74.78 133.35,72.87 IC5.4
AR3
  Top 0.254: IC2.16 131.44,73.51 133.35,71.6 IC5.5
AR4
  Top 0.254: IC2.15 131.44,72.24 133.35,70.33 IC5.6
AR5
  Top 0.254: IC2.14 131.44,70.97 133.35,69.06 IC5.7
AR6
  Top 0.254: IC2.13 131.44,69.7 133.35,67.79 IC5.8
AR7
  Top 0.254: IC2.12 131.44,68.43 133.35,66.52 IC5.9
AR8
  Top 0.254: IC3.19 IC6.2 136.53,39.85 138.43,37.95 138.43,25.25 135.89,22.71 IC9.1
AR9
  Top 0.254: IC3.18 IC6.3 136.53,38.58 137.79,37.31 137.79,25.88 135.25,23.34 135.25,21.44 IC9.2
AR10
  Top 0.254: IC3.17 IC6.4 136.53,37.31 137.16,36.68 137.16,26.52 134.62,23.98 134.62,20.8 135.25,20.17 IC9.3
AR11
  Top 0.254: IC6.5 IC3.16 128.91,36.04 126.36,38.58 126.36,53.19 122.56,57 IC8.2
AR12
  Top 0.254: IC6.6 IC3.15 128.91,34.77 125.73,37.95 125.73,51.28 122.56,54.46 IC8.4
AR13
  Top 0.254: IC6.7 IC3.14 128.91,33.5 125.09,37.31 125.09,49.38 122.56,51.92 IC8.6
AR14
  Top 0.254: IC6.8 IC3.13 128.91,32.23 124.46,36.68 124.46,47.47 122.56,49.38 IC8.8
AR15  (via drill 0.3)
  Top 0.254: IC3.12 v128.91,30.96 IC6.9 | v128.91,46.84 IC8.11
  Bottom 0.254: v128.91,30.96 v128.91,46.84
DR0  (via drill 0.3)
  Top 0.254: IC20.3 40.01,77.32 40.64,77.95 45.34,77.95 45.97,78.59 v48.64,78.59 IC24.2 | IC26.2 v53.34,62.08
  Bottom 0.254: v48.64,78.59 53.34,73.89 v53.34,62.08
DR1  (via drill 0.3)
  Top 0.254: IC20.2 37.72,78.59 37.47,78.33 37.47,76.94 37.72,76.68 45.97,76.68 46.61,77.32 v48.64,77.32 IC24.3 | IC26.3 v53.34,60.81
  Bottom 0.254: v53.34,60.81 52.7,61.44 52.7,73.25 v48.64,77.32
DR2  (via drill 0.3)
  Top 0.254: IC20.6 39.88,73.51 41.78,75.41 46.61,75.41 47.24,76.05 v48.64,76.05 IC24.4 | IC26.4 v52.7,59.54
  Bottom 0.254: v52.7,59.54 52.07,60.17 52.07,72.62 v48.64,76.05
DR3  (via drill 0.3)
  Top 0.254: IC20.7 41.15,72.24 43.05,74.14 47.24,74.14 47.88,74.78 v48.64,74.78 IC24.5 | IC26.5 v52.07,58.27
  Bottom 0.254: v52.07,58.27 51.44,58.9 51.44,71.98 v48.64,74.78
DR4  (via drill 0.3)
  Top 0.254: IC21.3 41.27,58.27 41.91,57.63 48.26,57.63 48.9,57 IC26.6 v52.07,57 | v48.64,73.51 IC24.6
  Bottom 0.254: v52.07,57 50.8,58.27 50.8,71.35 v48.64,73.51
DR5  (via drill 0.3)
  Top 0.254: IC21.2 37.72,59.54 37.47,59.28 37.47,57.89 37.72,57.63 40.01,57.63 41.27,56.36 48.26,56.36 48.9,55.73 IC26.7 v52.07,55.73 | v48.64,72.24 IC24.7
  Bottom 0.254: v52.07,55.73 50.16,57.63 50.16,70.71 v48.64,72.24
DR6  (via drill 0.3)
  Top 0.254: IC21.6 40.64,54.46 41.27,55.09 48.26,55.09 48.9,54.46 IC26.8 v52.07,54.46 | v48.64,70.97 IC24.8
  Bottom 0.254: v52.07,54.46 49.53,57 49.53,70.08 v48.64,70.97
DR7  (via drill 0.3)
  Top 0.254: IC21.7 40.64,53.19 41.27,53.82 48.26,53.82 48.9,53.19 IC26.9 v52.07,53.19 | v48.64,69.7 IC24.9
  Bottom 0.254: v52.07,53.19 48.9,56.36 48.9,69.44 v48.64,69.7
DR8  (via drill 0.3)
  Top 0.254: IC22.3 40.01,44.3 40.64,44.93 46.99,44.93 47.62,45.57 IC25.2 v48.26,45.57 | IC27.2 v53.98,29.06
  Bottom 0.254: v53.98,29.06 53.98,39.85 v48.26,45.57
DR9  (via drill 0.3)
  Top 0.254: IC22.2 37.72,45.57 37.47,45.31 37.47,43.92 37.72,43.66 46.99,43.66 47.62,44.3 v48.26,44.3 IC25.3 | IC27.3 v53.34,27.79
  Bottom 0.254: v53.34,27.79 53.34,39.22 v48.26,44.3
DR10  (via drill 0.3)
  Top 0.254: IC22.6 39.37,40.49 41.27,42.39 46.99,42.39 47.62,43.03 IC25.4 v48.26,43.03 | IC27.4 v52.7,26.52
  Bottom 0.254: v48.26,43.03 52.7,38.58 v52.7,26.52
DR11  (via drill 0.3)
  Top 0.254: IC22.7 40.64,39.22 42.55,41.12 46.99,41.12 47.62,41.76 v48.26,41.76 IC25.5 | IC27.5 v52.07,25.25
  Bottom 0.254: v48.26,41.76 52.07,37.95 v52.07,25.25
DR12  (via drill 0.3)
  Top 0.254: IC23.3 40.64,25.25 41.27,24.61 48.26,24.61 48.9,23.98 IC27.6 v52.07,23.98 | v48.26,40.49 IC25.6
  Bottom 0.254: v48.26,40.49 51.44,37.31 51.44,24.61 v52.07,23.98
DR13  (via drill 0.3)
  Top 0.254: IC23.2 37.72,26.52 37.47,26.26 37.47,24.87 37.72,24.61 40.01,24.61 41.27,23.34 48.26,23.34 48.9,22.71 IC27.7 v52.07,22.71 | v48.26,39.22 IC25.7
  Bottom 0.254: v52.07,22.71 50.8,23.98 50.8,36.68 v48.26,39.22
DR14  (via drill 0.3)
  Top 0.254: IC23.6 40.01,21.44 40.64,22.07 47.62,22.07 48.26,21.44 IC27.8 v52.07,21.44 | v48.26,37.95 IC25.8
  Bottom 0.254: v52.07,21.44 50.16,23.34 50.16,36.04 v48.26,37.95
DR15  (via drill 0.3)
  Top 0.254: IC23.7 41.91,20.17 42.55,20.8 46.99,20.8 47.62,20.17 IC27.9 v52.07,20.17 | v48.51,36.68 IC25.9
  Bottom 0.254: v52.07,20.17 49.53,22.71 49.53,35.66 v48.51,36.68
FNEG
  Bottom 0.254: X1.P$2 24.13,85.57 P2.11
FZERO  (via drill 0.3)
  Top 0.254: v25.4,90.65 52.07,90.65 52.7,91.29 79.38,91.29 80.01,91.92 83.82,91.92 84.45,92.56 v105.41,92.56
  Bottom 0.254: v105.41,92.56 105.41,83.03 103.89,81.51 R2.1 | P2.12 v25.4,90.65
GND  (via drill 0.3)
  Top 0.203: 58.8,75.41 63.5,75.41 | 26.04,75.41 29.21,75.41 | 26.04,71.6 29.21,71.6 | 26.04,70.33 29.21,70.33 | 26.04,69.06 29.21,69.06 | 26.42,72.87 29.84,72.87 | 25.4,58.9 29.84,58.9 | 25.4,57.63 29.84,57.63 | 57.78,74.14 63.5,74.14 | 47.62,77.95 52.07,77.95 | 47.62,76.68 52.07,76.68 | 48.01,75.41 52.07,75.41 | 48.26,74.14 52.07,74.14 | 58.8,76.68 62.87,76.68 | 26.04,43.66 29.84,43.66 | 58.42,43.66 62.23,43.66 | 58.42,42.39 62.23,42.39
  Top 0.254: v81.03,63.35 IC37.1 | v142.49,41.25 142.51,41.27 | IC2.1 v124.84,78.59 | IC3.1 v122.3,41.12 | IC24.19 v61.85,78.59
  Top 0.305: IC20.8 v41.02,70.97
  Top 0.61: v4.95,70.97 IC11.8 | IC12.8 v5.08,51.92 | v16.38,51.92 IC17.10 | v4.95,37.95 IC13.8 | v16.26,35.41 IC16.10 | IC14.8 v5.08,18.9 | v16.38,18.9 IC18.10 | v37.47,18.9 IC23.8 | IC27.10 v51.56,18.9 | IC31.8 v69.85,18.9 | v81.15,18.9 IC38.10 | v37.34,37.95 IC22.8 | IC25.10 v48.77,35.41 | IC21.8 v39.75,51.92 | IC26.10 v52.07,51.92 | v47.88,68.43 IC24.10 | v16.38,63.35 IC17.1 | IC17.19 v26.04,62.08 | IC29.8 v72.39,51.92 | v80.64,51.92 IC37.10 | IC28.8 v72.39,70.97 | v79.38,68.43 IC32.10 | v81.15,35.41 IC33.10 | IC30.8 v72.14,37.95 | IC38.19 v94.23,29.06 | IC27.19 v58.42,29.06 | IC27.1 v48.77,30.33 | v16.38,30.33 IC18.1 | IC15.19 v29.72,78.59 30.99,78.59 31.24,78.33 32.38,78.33 32.64,78.59 | v47.88,63.35 IC26.1 | IC26.19 v62.23,62.08 | IC37.19 v94.61,62.08 | IC32.19 v94.11,78.59 | v133.1,29.69 IC6.10 | IC3.10 v122.3,29.69 | IC6.19 143.51,39.85 142.49,40.87 v142.49,41.25 | v132.72,65.25 IC5.10 | IC2.10 v121.92,67.16 | IC9.8 v135.25,13.82 | v16.13,68.43 IC15.10 | v81.03,30.33 IC38.1 | IC33.19 v94.61,45.57 | v97.16,30.33 IC34.1 | C2.1 v132.72,80.49 | C3.1 v133.1,43.03 | C4.1 142.51,77.08 v142.49,77.06 142.49,76.43 143.51,75.41 IC5.19 | 142.51,41.27 C5.1 | C1.1 v143.76,54.46 | v142.62,59.54 142.62,58.86 IC1.3 | C9.1 v132.84,60.17 | C8.1 143.24,26.03 v143.13,26.14 | C11.1 v141.6,5.56 | C12.1 v14.1,81.76 | C15.1 12.45,29.69 v12.45,30.96 | C16.1 28.3,81.4 29.32,81.4 v29.34,81.38 | C18.1 30.1,49.27 v30.1,47.35 | 29.57,31.87 C19.2 v31.24,32.23 | IC16.19 v30.1,45.57 | C33.1 v78.87,81.76 | C23.1 v47.75,81.76 | C25.1 v47.62,48.74 | v58.29,32.23 C30.2 | v72.39,29.69 C36.1 | C40.1 v94.87,32.23 | C35.1 v78.87,48.74 | v56.01,48.74 C29.1 | C42.1 v105.16,32.23 | v72.9,62.71 C34.1 | C28.1 v62.48,65.25 | C24.1 v41.02,62.71
  Top 0.61: C17.1 v28.07,65.25 | C41.1 v111.76,65.25 | C37.1 v94.74,81.76 | C14.1 v8.13,48.74 | 57.15,45.57 v56.52,46.2 | v106.3,47.47 C45.1 | C21.1 v66.93,63.35 | C26.1 41.53,29.71 v41.53,30.96 | IC9.5 v138.43,17.63 | v140.34,10.64 140.34,9.71 IC10.3 | v130.18,12.8 131.43,12.8 C10.1 | C31.1 4.06,32.22 v4.06,30.96 | IC8.7 v122.56,50.65 | IC8.5 v122.56,53.19 | IC8.3 v122.56,55.73 | IC8.9 122.56,48.11 | C20.1 4.06,65.24 v4.06,64.11 | C32.1 v69.98,16.36 | v139.45,48.11 C44.1 | C13.1 13.06,63.62 v12.57,64.11 | C27.1 v61.34,81.76 | C48.1 v33.02,21.06 | C39.1 94.5,48.74 v93.98,48.74 | C38.1 v96.65,65.25
  Bottom 0.203: 134.49,25.25 137.16,25.25 | 134.49,23.98 137.16,23.98 | 134.49,22.71 137.16,22.71 | 134.49,21.44 137.03,21.44
  Bottom 0.61: C22.1 64.77,80.49 66.04,80.49
  other vias: 103.5,19.53 107.31,58.9 106.68,56.36 104.14,24.61 128.91,49.38 106.68,23.34 100.97,51.92 102.23,53.19 24,28.8 21.59,59.54 19.68,53.19 23.5,59.54 21.59,53.19 36.2,53.57 34.29,53.57 30.48,53.44 54.61,53.82 64.14,57.63 79.38,56.36 20.32,77.95 21.97,70.84 23.75,70.84 36.2,76.05 65.53,75.29 53.34,76.68 20.95,44.3 34.29,43.03 52.7,44.3 55.24,39.85 57.15,42.39 67.06,42.65 85.09,43.66 67.06,45.82 86.23,41.12 122.56,46.84 35.81,78.84 30.35,75.54 128.91,55.73
  pour Bottom (isolate 0.254, rank 6): 0,100.18 0,0.48 160.02,0.48 160.02,100.18
  pour Top (isolate 0.254, rank 4): 98.17,18.64 110.11,18.64 110.11,29.31 98.17,29.31
  pour Top (isolate 0.254, rank 4, no thermals): 98.17,51.66 110.11,51.66 110.11,60.93 98.17,60.93
  pour Top (isolate 0.254, rank 4): 121.67,46.58 131.7,46.58 131.7,57.63 128.91,57.63 128.27,58.27 121.67,58.27
  pour Top (isolate 0.254): 19.05,60.81 41.91,60.81 42.55,60.17 47.62,60.17 48.9,61.44 69.22,61.44 69.85,60.81 71.75,60.81 71.75,60.17 74.3,60.17 74.93,59.54 75.56,59.54 75.56,58.9 79.38,58.9 81.28,57 82.55,57 82.55,51.92 19.05,51.92
  pour Top (isolate 0.254): 19.05,79.22 24.13,79.22 26.04,77.32 34.92,77.32 36.83,79.22 41.27,79.22 41.91,78.59 46.99,78.59 47.62,79.22 52.07,79.22 53.34,77.95 55.24,77.95 55.88,77.32 67.31,77.32 69.22,79.22 73.66,79.22 74.3,78.59 74.93,78.59 74.93,76.68 75.56,76.05 76.2,76.05 76.2,75.41 80.01,75.41 81.92,73.51 83.19,73.51 83.19,67.79 74.93,67.79 74.3,68.43 55.24,68.43 54.61,67.79 45.09,67.79 44.45,68.43 19.05,68.43
  pour Top (isolate 0.254): 19.05,46.2 19.05,38.58 91.44,38.58 91.44,46.2 78.74,46.2 78.11,45.57 75.56,45.57 74.3,46.84 66.67,46.84 66.04,46.2 58.42,46.2 57.15,47.47 53.98,47.47 52.7,46.2 51.44,46.2 51.44,45.57 41.91,45.57 41.27,46.2 36.83,46.2 34.92,44.3 26.04,44.3 24.13,46.2
  pour Top (isolate 0.254): 27.94,79.22 27.94,77.32 35.56,77.32 37.47,79.22 37.47,79.86 32.38,79.86 31.75,79.22
  pour Top (isolate 0.254): 17.78,29.69 17.78,27.15 27.3,27.15 27.3,29.69
IBUS0  (via drill 0.3)
  Top 0.254: IC11.15 14.61,78.59 15.24,79.22 22.23,79.22 24.13,77.32 IC15.18 35.56,77.32 37.21,78.97 v37.21,79.22 41.27,79.22 41.91,78.59 IC20.15 45.09,78.59 45.72,79.22 52.07,79.22 53.34,77.95 55.24,77.95 55.88,77.32 IC24.18 66.93,77.32 68.83,79.22 73.66,79.22 74.3,78.59 IC28.15 78.11,78.59 78.74,79.22 86.36,79.22 88.27,77.32 IC32.18 IC2.2
  Bottom 0.254: P2.21 37.47,83.67 37.47,79.48 v37.21,79.22
IBUS1  (via drill 0.3)
  Top 0.254: IC2.3 IC32.17 86.36,76.05 85.72,75.41 80.01,75.41 79.38,74.78 v77.72,74.78 | IC11.1 9.53,79.86 10.16,79.22 13.97,79.22 15.24,80.49 24.77,80.49 26.04,79.22 v31.75,79.22 32.38,79.86 v36.2,79.86 IC20.1 38.73,80.03 | v31.75,76.68 29.84,76.68 29.21,76.05 IC15.17 | v77.47,79.22 74.93,79.22 74.3,79.86 IC28.1 v68.58,79.86 | v68.58,77.32 67.31,76.05 IC24.17 v58.42,76.05 | v31.75,67.16 32.38,67.16 33.02,66.52 40.64,66.52 41.27,65.89 45.09,65.89 45.72,66.52 55.88,66.52 57.15,67.79 v57.78,67.79
  Bottom 0.254: v31.75,79.22 v31.75,76.68 v31.75,67.16 | v68.58,77.32 v68.58,79.86 | v77.47,79.22 77.47,75.03 v77.72,74.78 | P2.22 36.83,85.57 36.83,80.49 v36.2,79.86 | v58.42,76.05 57.78,75.41 v57.78,67.79
IBUS2  (via drill 0.3)
  Top 0.254: IC11.10 13.97,72.24 14.61,72.87 23.5,72.87 25.4,74.78 IC15.16 33.66,74.78 36.83,71.6 v40.01,71.6 41.91,71.6 42.55,72.24 IC20.10 47.62,72.24 48.26,72.87 52.07,72.87 53.98,74.78 IC24.16 64.77,74.78 67.94,71.6 73.66,71.6 74.3,72.24 IC28.10 78.11,72.24 78.74,72.87 85.72,72.87 87.63,74.78 IC32.16 IC2.4
  Bottom 0.254: P2.23 40.64,83.67 38.73,81.76 38.73,72.87 v40.01,71.6
IBUS3  (via drill 0.3)
  Top 0.254: IC11.9 14.61,70.97 15.24,71.6 24.13,71.6 26.04,73.51 IC15.15 33.66,73.51 36.83,70.33 v40.01,70.33 41.91,70.33 42.55,70.97 IC20.9 46.35,70.97 46.99,71.6 52.7,71.6 54.61,73.51 IC24.15 64.14,73.51 67.31,70.33 74.3,70.33 74.93,70.97 IC28.9 78.11,70.97 78.74,71.6 87,71.6 88.9,73.51 IC32.15 IC2.5
  Bottom 0.254: P2.24 39.37,85.57 39.37,83.67 38.1,82.4 38.1,72.24 v40.01,70.33
IBUS4  (via drill 0.3)
  Top 0.254: IC15.14 33.66,72.24 36.2,69.7 v43.18,69.7 46.99,69.7 47.62,70.33 53.34,70.33 55.24,72.24 IC24.14 63.5,72.24 66.04,69.7 78.11,69.7 78.74,70.33 88.27,70.33 90.17,72.24 IC32.14 IC2.6 | IC12.15 15.24,59.54 15.88,60.17 41.27,60.17 41.91,59.54 v42.55,59.54 IC21.15 48.26,59.54 48.9,60.17 74.3,60.17 74.93,59.54 IC29.15
  Bottom 0.254: P2.25 v43.18,69.7 43.18,68.05 42.55,67.41 v42.55,59.54
IBUS5  (via drill 0.3)
  Top 0.254: IC15.13 v29.84,70.97 33.66,70.97 35.56,69.06 v41.91,69.06 53.98,69.06 55.88,70.97 IC24.13 62.87,70.97 64.77,69.06 89.53,69.06 91.44,70.97 IC32.13 IC2.7 | IC12.1 9.53,60.81 10.16,60.17 14.61,60.17 15.88,61.44 v30.48,61.44 36.83,61.44 37.47,60.81 IC21.1 41.91,60.81 42.55,60.17 46.99,60.17 48.26,61.44 69.22,61.44 69.85,60.81 IC29.1
  Bottom 0.254: v30.48,61.44 30.48,66.4 29.84,67.03 v29.84,70.97 | P2.26 41.91,85.57 41.91,83.03 41.27,82.4 41.27,76.05 41.91,75.41 v41.91,69.06
IBUS6  (via drill 0.3)
  Top 0.254: IC15.12 33.66,69.7 34.92,68.43 v44.45,68.43 45.09,67.79 54.61,67.79 56.52,69.7 IC24.12 62.23,69.7 63.5,68.43 v74.3,68.43 74.93,67.79 89.53,67.79 91.44,69.7 IC32.12 IC2.8 | IC12.10 14.61,53.19 15.24,52.55 41.27,52.55 41.91,53.19 IC21.10 47.62,53.19 48.26,52.55 73.66,52.55 v74.3,53.19 IC29.10
  Bottom 0.254: v44.45,68.43 44.45,82.4 45.72,83.67 P2.27 | v74.3,53.19 v74.3,68.43
IBUS7  (via drill 0.3)
  Top 0.254: IC15.11 33.66,68.43 34.29,67.79 41.91,67.79 42.55,67.16 v43.43,67.16 55.24,67.16 56.52,68.43 IC24.11 61.59,68.43 62.23,67.79 v73.66,67.79 74.3,67.16 90.17,67.16 91.44,68.43 IC32.11 v118.11,68.43 IC2.9 | IC12.9 13.97,51.92 14.61,51.28 29.21,51.28 29.84,51.92 36.83,51.92 37.47,51.28 41.91,51.28 42.55,51.92 IC21.9 48.26,51.92 48.9,51.28 v73.66,51.28 74.3,51.28 74.93,51.92 IC29.9
  Bottom 0.254: IC4.1 120.65,27.15 120.02,27.79 120.02,37.31 118.75,38.58 118.75,41.12 118.11,41.76 v118.11,68.43 | P2.28 44.45,85.57 44.45,83.67 43.81,83.03 43.81,67.54 v43.43,67.16 | v73.66,51.28 v73.66,67.79
IBUS8  (via drill 0.3)
  Top 0.254: IC13.15 13.97,45.57 14.61,46.2 24.13,46.2 26.04,44.3 IC16.18 34.92,44.3 36.83,46.2 v40.64,46.2 41.27,46.2 41.91,45.57 IC22.15 v46.35,45.57 46.99,46.2 52.7,46.2 54.61,44.3 IC25.18 67.31,44.3 69.22,46.2 73.66,46.2 74.3,45.57 IC30.15 78.99,45.57 79.63,46.2 85.72,46.2 86.36,45.57 89.53,45.57 90.81,44.3 IC33.18 114.3,44.3 v117.47,41.12 118.75,39.85 IC3.2
  Bottom 0.254: IC4.4 120.02,23.34 118.11,25.25 118.11,40.49 v117.47,41.12 | P2.29 48.26,83.67 45.72,81.13 45.72,76.05 46.99,74.78 46.99,70.97 46.35,70.33 46.35,65.89 44.45,63.98 44.45,50.01 46.35,48.11 v46.35,45.57
IBUS9  (via drill 0.3)
  Top 0.254: IC3.3 118.75,38.58 v116.84,40.49 114.3,43.03 IC33.17 v90.81,43.03 | IC13.1 9.53,46.84 10.16,46.2 13.34,46.2 14.61,47.47 v24.13,47.47 26.67,44.93 34.29,44.93 36.2,46.84 IC22.1 41.91,46.84 42.55,46.2 v45.47,46.2 46.1,46.84 v48.26,46.84 48.9,47.47 57.15,47.47 58.42,46.2 66.04,46.2 66.67,46.84 IC30.1 74.3,46.84 74.93,46.2 78.61,46.2 79.88,47.47 88.27,47.47 88.9,46.84 v90.81,46.84 | v24.13,43.03 IC16.17 | v52.7,43.03 IC25.17
  Bottom 0.254: v24.13,47.47 v24.13,43.03 | IC4.5 120.02,22.07 117.47,24.61 117.47,39.85 v116.84,40.49 | v48.26,46.84 52.07,43.03 v52.7,43.03 | v90.81,46.84 v90.81,43.03 | P2.30 46.99,85.57 46.99,83.67 45.09,81.76 45.09,75.41 46.35,74.14 46.35,71.6 45.72,70.97 45.72,66.52 43.81,64.62 43.81,49.38 45.47,47.73 v45.47,46.2
IBUS10  (via drill 0.3)
  Top 0.254: IC13.10 13.97,39.22 14.61,39.85 23.5,39.85 25.4,41.76 IC16.16 33.02,41.76 36.2,38.58 41.91,38.58 42.55,39.22 IC22.10 46.99,39.22 47.62,39.85 52.7,39.85 54.61,41.76 IC25.16 63.5,41.76 66.67,38.58 v67.94,38.58 74.3,38.58 74.93,39.22 IC30.10 78.11,39.22 78.74,39.85 87.63,39.85 89.53,41.76 IC33.16 114.3,41.76 v118.75,37.31 IC3.4 | v53.34,79.86 57.78,79.86 58.42,79.22 v66.67,79.22
  Bottom 0.254: IC4.2 120.02,25.88 119.38,26.52 119.38,36.68 v118.75,37.31 | v66.67,79.22 67.31,78.59 67.31,72.87 68.58,71.6 68.58,59.54 67.31,58.27 67.31,55.73 67.94,55.09 v67.94,38.58 | P2.31 50.8,82.4 v53.34,79.86
IBUS11  (via drill 0.3)
  Top 0.254: IC13.9 15.88,37.95 16.51,38.58 24.77,38.58 26.67,40.49 IC16.15 32.38,40.49 35.56,37.31 41.91,37.31 42.55,37.95 IC22.9 46.99,37.95 47.62,38.58 57.15,38.58 v58.42,39.85 59.05,40.49 IC25.15 63.5,40.49 66.67,37.31 74.3,37.31 74.93,37.95 IC30.9 78.11,37.95 78.74,38.58 87.63,38.58 89.53,40.49 IC33.15 114.3,40.49 v118.75,36.04 IC3.5
  Bottom 0.254: IC4.3 120.02,24.61 118.75,25.88 v118.75,36.04 | P2.32 52.07,85.57 52.07,83.03 54.61,80.49 54.61,57 57.15,54.46 57.15,51.28 58.42,50.01 v58.42,39.85
IBUS12  (via drill 0.3)
  Top 0.254: IC16.14 v29.84,39.22 31.75,39.22 34.29,36.68 v45.09,36.68 47.12,36.68 47.75,37.31 52.07,37.31 52.7,37.95 57.78,37.95 v58.74,38.9 59.05,39.22 IC25.14 63.5,39.22 66.04,36.68 v75.56,36.68 78.11,36.68 78.74,37.31 88.9,37.31 90.81,39.22 IC33.14 114.3,39.22 118.75,34.77 IC3.6 | IC14.15 12.7,26.52 13.34,27.15 v29.84,27.15 | v46.35,26.52 IC23.15 | v74.93,26.52 IC31.15
  Bottom 0.254: v74.93,26.52 74.93,36.04 v75.56,36.68 | P2.33 53.34,83.03 55.24,81.13 55.24,57.63 57.78,55.09 57.78,51.92 59.05,50.65 59.05,39.22 v58.74,38.9 | v46.35,26.52 46.35,35.41 v45.09,36.68 | v29.84,27.15 v29.84,39.22
IBUS13  (via drill 0.3)
  Top 0.254: IC16.13 v30.48,37.95 31.11,37.95 33.02,36.04 v37.47,36.04 52.07,36.04 53.34,37.31 58.42,37.31 v58.74,37.63 59.05,37.95 IC25.13 63.5,37.95 65.41,36.04 v67.94,36.04 84.45,36.04 85.09,36.68 89.53,36.68 90.81,37.95 IC33.13 93.98,37.95 94.61,38.58 113.67,38.58 118.75,33.5 IC3.7 | IC14.1 7.62,27.79 9.53,25.88 v15.24,25.88 | v37.47,27.79 IC23.1 | v67.94,28.42 69.22,28.42 69.85,27.79 IC31.1 | v15.24,29.69 v30.48,29.69
  Bottom 0.254: v67.94,36.04 v67.94,28.42 | P2.34 54.61,85.57 54.61,83.03 55.88,81.76 55.88,58.27 58.42,55.73 58.42,52.55 59.69,51.28 59.69,38.58 v58.74,37.63 | v37.47,36.04 v37.47,27.79 | v15.24,25.88 v15.24,29.69 | v30.48,29.69 v30.48,37.95
IBUS14  (via drill 0.3)
  Top 0.254: IC3.8 118.75,32.23 113.03,37.95 95.25,37.95 93.98,36.68 IC33.12 90.81,36.68 90.17,36.04 85.72,36.04 84.45,34.77 80.01,34.77 v79.38,35.41 64.77,35.41 63.5,36.68 IC25.12 59.05,36.68 v58.74,36.36 58.42,36.68 53.98,36.68 52.07,34.77 48.01,34.77 47.37,35.41 v45.09,35.41 31.75,35.41 30.48,36.68 IC16.12 20.45,36.68 19.81,37.31 13.97,37.31 13.34,36.68 v11.43,36.68 | v46.35,20.17 IC23.10 | IC31.10 78.74,20.17 v79.38,19.53 | IC14.10 12.7,20.17 v13.34,19.53
  Bottom 0.254: v45.09,35.41 45.09,23.34 46.35,22.07 v46.35,20.17 | v79.38,35.41 v79.38,19.53 | v11.43,36.68 11.43,21.44 v13.34,19.53 | P2.35 56.52,83.67 56.52,58.9 59.05,56.36 59.05,53.19 60.33,51.92 60.33,37.95 v58.74,36.36
IBUS15  (via drill 0.3)
  Top 0.203: v46.99,18.9 IC23.9
  Top 0.254: IC3.9 118.75,30.96 112.39,37.31 95.89,37.31 93.98,35.41 IC33.11 86.36,35.41 85.09,34.14 79.38,34.14 v78.74,34.77 64.14,34.77 63.5,35.41 IC25.11 v58.67,35.41 58.04,36.04 54.61,36.04 52.7,34.14 47.62,34.14 46.99,34.77 v45.72,34.77 30.48,34.77 29.84,35.41 IC16.11 19.68,35.41 19.05,36.04 15.24,36.04 14.61,35.41 v8.89,35.41 | v78.11,18.9 IC31.9 | v8.89,18.9 IC14.9
  Bottom 0.254: v45.72,34.77 45.72,23.98 46.99,22.71 v46.99,18.9 | v78.74,34.77 78.74,20.17 78.11,19.53 v78.11,18.9 | v8.89,18.9 v8.89,35.41 | P2.36 57.15,85.57 57.15,59.54 59.69,57 59.69,53.82 60.96,52.55 60.96,37.31 59.05,35.41 v58.67,35.41
N$1  (via drill 0.3)
  Top 0.254: 27.3,60.81 IC17.18 v26.04,60.81
  Bottom 0.254: v26.04,60.81 29.21,57.63 29.21,18.9 31.75,16.36 31.75,11.91 29.21,9.37 15.24,9.37 12.7,11.91 P3.40
N$2  (via drill 0.3)
  Top 0.254: v26.04,57 IC17.15
  Bottom 0.254: v26.04,57 27.3,55.73 27.3,18.9 25.4,16.99 24.77,16.99 24.13,16.36 24.13,11.91 23.5,11.28 17.14,11.28 16.51,11.91 16.51,14.45 P3.37
N$3  (via drill 0.3)
  Top 0.254: v26.04,58.27 IC17.16
  Bottom 0.254: P3.38 15.24,11.91 16.51,10.64 25.4,10.64 26.67,11.91 26.67,16.99 27.94,18.26 27.94,56.36 v26.04,58.27
N$4  (via drill 0.3)
  Top 0.254: v26.04,59.54 IC17.17
  Bottom 0.254: v26.04,59.54 28.57,57 28.57,17.63 29.21,16.99 29.21,11.91 27.3,10.01 15.88,10.01 13.97,11.91 13.97,14.45 P3.39
N$5  (via drill 0.3)
  Top 0.254: v26.04,55.73 IC17.14
  Bottom 0.254: v26.04,55.73 26.67,55.09 26.67,19.53 24.77,17.63 22.23,17.63 21.59,16.99 21.59,12.55 20.95,11.91 19.05,11.91 P3.36
N$6  (via drill 0.3)
  Top 0.254: v26.04,54.46 IC17.13
  Bottom 0.254: v26.04,54.46 24.77,53.19 24.77,21.44 22.86,19.53 20.32,19.53 17.78,16.99 P3.35
N$7  (via drill 0.3)
  Top 0.254: v26.04,53.19 IC17.12
  Bottom 0.254: v26.04,53.19 25.4,52.55 25.4,20.8 23.5,18.9 20.95,18.9 19.05,16.99 19.05,14.45 P3.34
N$8  (via drill 0.3)
  Top 0.254: v26.04,51.92 IC17.11
  Bottom 0.254: v26.04,51.92 26.04,20.17 24.13,18.26 21.59,18.26 20.32,16.99 P3.33
N$9  (via drill 0.3)
  Top 0.254: v23.5,23.34 23.5,16.36 P3.31 | v23.5,26.52 IC18.17
  Bottom 0.254: v23.5,23.34 v23.5,26.52
N$10  (via drill 0.3)
  Top 0.254: v22.86,24.61 22.86,17.63 21.59,16.36 21.59,14.45 P3.32 | v22.86,27.79 IC18.18
  Bottom 0.254: v22.86,24.61 v22.86,27.79
N$11
  Top 0.254: IC18.16 26.67,25.25 24.13,22.71 24.13,14.45 P3.30
N$12
  Top 0.254: IC18.15 26.67,23.98 24.77,22.07 24.77,17.63 25.4,16.99 P3.29
N$13
  Top 0.254: IC18.14 26.67,22.71 25.4,21.44 25.4,18.01 26.67,16.74 26.67,14.45 P3.28
N$14
  Top 0.254: P3.27 27.94,16.48 26.04,18.39 26.04,20.8 26.67,21.44 IC18.13
N$15
  Top 0.254: IC18.12 29.21,20.17 31.75,17.63 31.75,14.45 P3.26
N$16
  Top 0.254: IC18.11 27.89,18.31 P3.25
N$17
  Top 0.254: P3.1 60.96,18.21 IC27.11
N$18
  Top 0.254: IC27.12 59.05,20.17 58.42,19.53 58.42,18.26 59.69,16.99 59.69,14.45 P3.2
N$19
  Top 0.254: IC27.13 59.05,21.44 57.78,20.17 57.78,16.36 P3.3
N$20
  Top 0.254: IC27.14 59.05,22.71 57.15,20.8 57.15,14.45 P3.4
N$21
  Top 0.254: IC27.15 59.05,23.98 56.52,21.44 56.52,16.36 P3.5
N$22
  Top 0.254: IC27.16 59.05,25.25 55.88,22.07 55.88,17.63 55.24,16.99 54.61,16.36 54.61,14.45 P3.6
N$23
  Top 0.254: P3.7 53.34,16.36 55.24,18.26 55.24,22.71 59.05,26.52 IC27.17
N$24
  Top 0.254: IC27.18 59.05,27.79 54.61,23.34 54.61,18.9 52.07,16.36 52.07,14.45 P3.8
N$25  (via drill 0.3)
  Top 0.254: v58.42,60.81 IC26.18 | v49.53,10.64 61.59,10.64 v62.87,11.91
  Bottom 0.254: P3.9 49.53,14.45 v49.53,10.64 | v58.42,60.81 60.96,58.27 60.96,55.09 62.23,53.82 62.23,23.34 62.87,22.71 v62.87,11.91
N$26  (via drill 0.3)
  Top 0.254: v58.42,59.54 IC26.17 | v50.8,11.28 v60.96,11.28
  Bottom 0.254: v58.42,59.54 60.33,57.63 60.33,54.46 61.59,53.19 61.59,22.71 62.23,22.07 62.23,12.55 v60.96,11.28 | v50.8,11.28 P3.10
N$27  (via drill 0.3)
  Top 0.254: v62.87,58.27 IC26.16 | v48.26,9.37 62.87,9.37 v64.14,10.64
  Bottom 0.254: P3.11 46.99,14.45 46.99,10.64 v48.26,9.37 | v62.87,58.27 62.87,55.73 63.5,55.09 63.5,24.61 64.14,23.98 v64.14,10.64
N$28  (via drill 0.3)
  Top 0.254: v62.23,57 IC26.15 | v62.87,10.64 62.23,10.01 v48.9,10.01
  Bottom 0.254: P3.12 48.26,10.64 v48.9,10.01 | v62.23,57 62.23,55.09 62.87,54.46 62.87,23.98 63.5,23.34 63.5,11.28 v62.87,10.64
N$29  (via drill 0.3)
  Top 0.254: v64.14,55.73 IC26.14 | v46.99,8.1 64.14,8.1 v65.41,9.37
  Bottom 0.254: v64.14,55.73 64.77,55.09 64.77,25.88 65.41,25.25 v65.41,9.37 | v46.99,8.1 44.45,10.64 44.45,14.45 P3.13
N$30  (via drill 0.3)
  Top 0.254: v64.14,54.46 IC26.13 | v64.14,9.37 63.5,8.74 v47.62,8.74
  Bottom 0.254: P3.14 45.72,10.64 v47.62,8.74 | v64.14,9.37 64.77,10.01 64.77,24.61 64.14,25.25 v64.14,54.46
N$31  (via drill 0.3)
  Top 0.254: v65.41,53.19 IC26.12 | v66.67,8.1 65.41,6.83 v45.72,6.83
  Bottom 0.254: P3.15 41.91,14.45 41.91,10.64 v45.72,6.83 | v65.41,53.19 66.04,52.55 66.04,27.15 66.67,26.52 v66.67,8.1
N$32  (via drill 0.3)